# EAGLE design Via Card v2 (EAGLE 4.16)
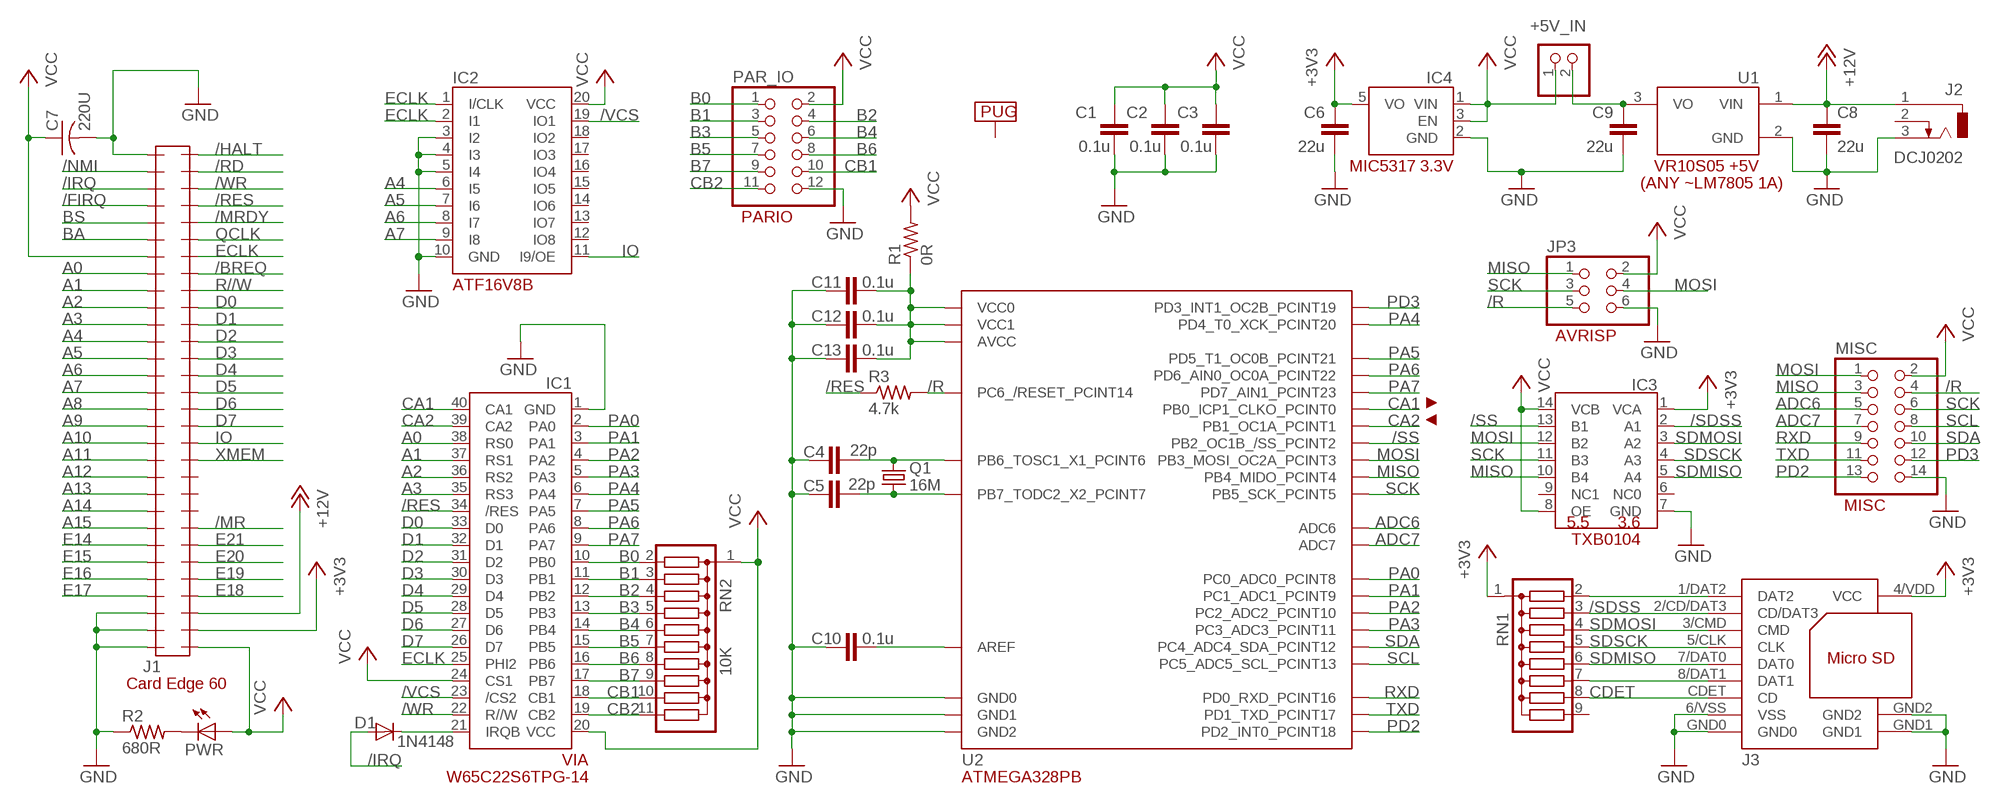
[diagram p0: schematic, sheet 1]

## Parts
+5V_IN  PINHD-1X2  [1X02]
C1  0.1u  C-EUC0603  [C0603]
C2  0.1u  C-EUC0603  [C0603]
C3  0.1u  C-EUC0603  [C0603]
C4  22p  C-EUC0603  [C0603]
C5  22p  C-EUC0603  [C0603]
C6  22u  C-EUC0805  [C0805]
C7  220U  C-US025-050X050  [C025-050X050]
C8  22u  C-EUC1206  [C1206]
C9  22u  C-EUC1206  [C1206]
C10  0.1u  C-EUC0603  [C0603]
C11  0.1u  C-EUC0603  [C0603]
C12  0.1u  C-EUC0603  [C0603]
C13  0.1u  C-EUC0603  [C0603]
D1  1N4148  [DO35-10]
IC1  W65C22S6TBG-14  [DIL40]
IC2  PLD_ATF16V8B  [DIL20]
IC3  TXB0104D  [SOIC14]
IC4  MIC5317_3.3V  [SOT23-5]
J1  CARDEDGE_2.54_60POS  CARDEDGE_2.54_60POSEDGE  [CARDEDGE_2.54_60POS]
J2  DCJ0202  [DCJ0202]
J3  MICROSD_AMPHENOL_GTFP084328  [MICROSD_AMPHENOL_GTFP08432B1HR]
JP3  PINHD-2X3  [2X03]
MISC  PINHD-2X7  [2X07]
PAR_IO  PINHD-2X6  [2X06]
PWR  LED3MM  [LED3MM]
Q1  16M  CRYSTALHC49S  [HC49/S]
R1  0R  R-US_R0603  [R0603]
R2  680R  R-US_R0603  [R0603]
R3  4.7k  R-US_R0603  [R0603]
RN1  G08R  [SIL9]
RN2  10K  G10R  [SIL11]
U1  VREG_5V_VR10S05  [VREG_5V_CP_POWER_VR10S05]
U2  ATMEGA238PTQFP_  [TQFP32-08]
U$1  PUG  [LARGE_PUG]

## Nets
+3V3 [supply]: C6.1 IC3.1(VCA) IC4.5(VO) J1.32 J3.4/VDD(VCC) RN1.1
+12V [supply]: C8.1 J1.33 J2.1 U1.1(VIN)
/BREQ: J1.53
/FIRQ: J1.4
/HALT: J1.60
/IRQ: D1.A J1.3
/MR: J1.38
/MRDY: J1.56
/NMI: J1.2
/R: JP3.5 MISC.4 R3.2 U2.29(PC6_/RESET_PCINT14)
/RD: J1.59
/RES: IC1.34(/RES) J1.57 R3.1
/SDSS: IC3.2(A1) J3.2/CD/DAT3(CD/DAT3) RN1.3
/SS: IC3.13(B1) U2.14(PB2_OC1B_/SS_PCINT2)
/VCS: IC1.23(/CS2) IC2.19(IO1)
/WR: IC1.22(R//W) J1.58
A0: IC1.38(RS0) J1.8
A1: IC1.37(RS1) J1.9
A2: IC1.36(RS2) J1.10
A3: IC1.35(RS3) J1.11
A4: IC2.6(I5) J1.12
A5: IC2.7(I6) J1.13
A6: IC2.8(I7) J1.14
A7: IC2.9(I8) J1.15
A8: J1.16
A9: J1.17
A10: J1.18
A11: J1.19
A12: J1.20
A13: J1.21
A14: J1.22
A15: J1.23
ADC6: MISC.5 U2.19(ADC6)
ADC7: MISC.7 U2.22(ADC7)
B0: IC1.10(PB0) PAR_IO.1 RN2.2
B1: IC1.11(PB1) PAR_IO.3 RN2.3
B2: IC1.12(PB2) PAR_IO.4 RN2.4
B3: IC1.13(PB3) PAR_IO.5 RN2.5
B4: IC1.14(PB4) PAR_IO.6 RN2.6
B5: IC1.15(PB5) PAR_IO.7 RN2.7
B6: IC1.16(PB6) PAR_IO.8 RN2.8
B7: IC1.17(PB7) PAR_IO.9 RN2.9
BA: J1.6
BS: J1.5
CA1: IC1.40(CA1) U2.12(PB0_ICP1_CLKO_PCINT0)
CA2: IC1.39(CA2) U2.13(PB1_OC1A_PCINT1)
CB1: IC1.18(CB1) PAR_IO.10 RN2.10
CB2: IC1.19(CB2) PAR_IO.11 RN2.11
CDET: J3.CDET(CD) RN1.8
D0: IC1.33(D0) J1.51
D1: IC1.32(D1) J1.50
D2: IC1.31(D2) J1.49
D3: IC1.30(D3) J1.48
D4: IC1.29(D4) J1.47
D5: IC1.28(D5) J1.46
D6: IC1.27(D6) J1.45
D7: IC1.26(D7) J1.44
E14: J1.24
E15: J1.25
E16: J1.26
E17: J1.27
E18: J1.34
E19: J1.35
E20: J1.36
E21: J1.37
ECLK: IC1.25(PHI2) IC2.1(I/CLK) IC2.2(I1) J1.54
GND [lowpwr]: C1.2 C2.2 C3.2 C4.1 C5.1 C6.2 C7.2 C8.2 C9.2 C10.1 C11.1 C12.1 C13.1 IC1.1(GND) IC2.3(I2) IC2.4(I3) IC2.5(I4) IC2.10(GND) IC3.7(GND) IC4.2(GND) J1.1 J1.28 J1.29 J1.30 J2.3 J3.6/VSS(VSS) J3.GND0 J3.GND1 J3.GND2 JP3.6 MISC.14 PAR_IO.12 R2.1 U1.2(GND) U2.3(GND0) U2.5(GND1) U2.21(GND2)
IO: IC2.11(I9/OE) J1.43
MISO: IC3.10(B4) JP3.1 MISC.3 U2.16(PB4_MIDO_PCINT4)
MOSI: IC3.12(B2) JP3.4 MISC.1 U2.15(PB3_MOSI_OC2A_PCINT3)
N$1: J3.1/DAT2(DAT2) RN1.2
N$2: PWR.K(C) R2.2
N$3 [lowpwr]: C11.2 C12.2 C13.2 R1.1 U2.4(VCC0) U2.6(VCC1) U2.18(AVCC)
N$6 [supply]: +5V_IN.2 C9.1 U1.3(VO)
N$7: J3.8/DAT1(DAT1) RN1.7
N$13: D1.C IC1.21(IRQB)
N$15: C4.2 Q1.2 U2.7(PB6_TOSC1_X1_PCINT6)
N$16: C5.2 Q1.1 U2.8(PB7_TODC2_X2_PCINT7)
N$18 [lowpwr]: C10.2 U2.20(AREF)
PA0: IC1.2(PA0) U2.23(PC0_ADC0_PCINT8)
PA1: IC1.3(PA1) U2.24(PC1_ADC1_PCINT9)
PA2: IC1.4(PA2) U2.25(PC2_ADC2_PCINT10)
PA3: IC1.5(PA3) U2.26(PC3_ADC3_PCINT11)
PA4: IC1.6(PA4) U2.2(PD4_T0_XCK_PCINT20)
PA5: IC1.7(PA5) U2.9(PD5_T1_OC0B_PCINT21)
PA6: IC1.8(PA6) U2.10(PD6_AIN0_OC0A_PCINT22)
PA7: IC1.9(PA7) U2.11(PD7_AIN1_PCINT23)
PD2: MISC.13 U2.32(PD2_INT0_PCINT18)
PD3: MISC.12 U2.1(PD3_INT1_OC2B_PCINT19)
QCLK: J1.55
R//W: J1.52
RXD: MISC.9 U2.30(PD0_RXD_PCINT16)
SCK: IC3.11(B3) JP3.3 MISC.6 U2.17(PB5_SCK_PCINT5)
SCL: MISC.8 U2.28(PC5_ADC5_SCL_PCINT13)
SDA: MISC.10 U2.27(PC4_ADC4_SDA_PCINT12)
SDMISO [lowpwr]: IC3.5(A4) J3.7/DAT0(DAT0) RN1.6
SDMOSI [lowpwr]: IC3.3(A2) J3.3/CMD(CMD) RN1.4
SDSCK [lowpwr]: IC3.4(A3) J3.5/CLK(CLK) RN1.5
TXD: MISC.11 U2.31(PD1_TXD_PCINT17)
VCC [supply]: +5V_IN.1 C1.1 C2.1 C3.1 C7.1 IC1.20(VCC) IC1.24(CS1) IC2.20(VCC) IC3.8(OE) IC3.14(VCB) IC4.1(VIN) IC4.3(EN) J1.7 J1.31 JP3.2 MISC.2 PAR_IO.2 PWR.A R1.2 RN2.1
XMEM: J1.42
Unconnected: IC2.12(IO8) IC2.13(IO7) IC2.14(IO6) IC2.15(IO5) IC2.16(IO4) IC2.17(IO3) IC2.18(IO2) IC3.6(NC0) IC3.9(NC1) J1.39 J1.40 J1.41 J2.2 RN1.9 U$1.P$1

## Notes on the sheet
- (ANY ~LM7805 1A)
- PARIO
- AVRISP
- MISC
- ATMEGA328PB

## Library data of the parts
+5V_IN = pinhead:PINHD-1X2: PIN HEADER
C1-C6 C8-C13 = rcl:C-EU: CAPACITOR, European symbol
C7 = rcl:C-US: CAPACITOR, American symbol
D1 = diode:1N4148: DIODE high speed (Philips)
IC1 = 07-Retrocomputing:W65C22S6TBG-14
IC2 = 07-Retrocomputing:PLD_ATF16V8B
IC3 = 07-Retrocomputing:TXB0104
IC4 = 07-Retrocomputing:MIC5317_3.3V
J1 = 07-Retrocomputing:CARDEDGE_2.54_60POS
J2 = con-jack:DCJ0202: DC POWER JACK Source: DCJ0202.pdf
J3 = 07-Retrocomputing:MICROSD_AMPHENOL_GTFP084328
JP3 = pinhead:PINHD-2X3: PIN HEADER
MISC = pinhead:PINHD-2X7: PIN HEADER
PAR_IO = pinhead:PINHD-2X6: PIN HEADER
PWR = led:LED: LED OSRAM: - CHIPLED LG R971, LG N971, LY N971, LG Q971, LY Q971, LO R971, LY R971 LH N974, LH R974 LS Q976, LO Q976, LY Q976 LO Q996 - Hyper CHIPLED LW Q18S LB Q993, LB Q99A, LB R99A - SideLED LS A670, LO A670, LY A670, LG A670, LP A670 LB A673, LV A673, LT A673, LW A673 LH A674 LY A675 LS A676, LA A676, LO A676, LY A676, LW A676 LS A679, LY A679, LG A679 - Hyper Micro SIDELED® LS Y876, LA Y876, LO Y876, LY Y876 LT Y87S - SmartLED LW L88C, LW L88S LB L89C, LB L89S, LG L890 LS L89K, LO L89K, LY L89K LS L896, LA L896, LO L896, LY L896 - TOPLED LS T670, LO T670, LY T670, LG T670, LP T670 LSG T670, LSP T670, LSY T670, LOP T670, LYG T670 LG T671, LOG T671, LSG T671 LB T673, LV T673, LT T673, LW T673 LH T674 LS T676, LA T676, LO T676, LY T676, LB T676, LH T676, LSB T676, LW T676 LB T67C, LV T67C, LT T67C, LS T67K, LO T67K, LY T67K, LW E67C LS E67B, LA E67B, LO E67B, LY E67B, LB E67C, LV E67C, LT E67C LW T67C LS T679, LY T679, LG T679 LS T770, LO T770, LY T770, LG T770, LP T770 LB T773, LV T773, LT T773, LW T773 LH T774 LS E675, LA E675, LY E675, LS T675 LS T776, LA T776, LO T776, LY T776, LB T776 LHGB T686 LT T68C, LB T68C - Hyper Mini TOPLED® LB M676 - Mini TOPLED Santana® LG M470 LS M47K, LO M47K, LY M47K Source: http://www.osram.convergy.de - LUMILED® LXK2-PW12-R00, LXK2-PW12-S00, LXK2-PW14-U00, LXK2-PW14-V00 LXK2-PM12-R00, LXK2-PM12-S00, LXK2-PM14-U00 LXK2-PE12-Q00, LXK2-PE12-R00, LXK2-PE12-S00, LXK2-PE14-T00, LXK2-PE14-U00 LXK2-PB12-K00, LXK2-PB12-L00, LXK2-PB12-M00, LXK2-PB14-N00, LXK2-PB14-P00, LXK2-PB14-Q00 LXK2-PR12-L00, LXK2-PR12-M00, LXK2-PR14-Q00, LXK2-PR14-R00 LXK2-PD12-Q00, LXK2-PD12-R00, LXK2-PD12-S00 LXK2-PH12-R00, LXK2-PH12-S00 LXK2-PL12-P00, LXK2-PL12-Q00, LXK2-PL12-R00 Source: www.luxeon.com
Q1 = crystal:CRYSTAL: CRYSTAL
R1-R3 = rcl:R-US_: RESISTOR, American symbol
RN1 = resistor-sil:G08R: SIL RESISTOR
RN2 = resistor-sil:G10R: SIL RESISTOR
U1 = 07-Retrocomputing:VREG_5V_VR10S05
U2 = 02_atmel:ATMEGA238P
U$1 = 07-Retrocomputing:PUG

## Net classes
0 default: width 0.203 mm, drill 0.203 mm, clearance 0.254 mm
1 supply: width 0.61 mm, drill 0.203 mm, clearance 0.305 mm
2 lowpwr: width 0.254 mm, drill 0.203 mm, clearance 0.254 mm

## Board
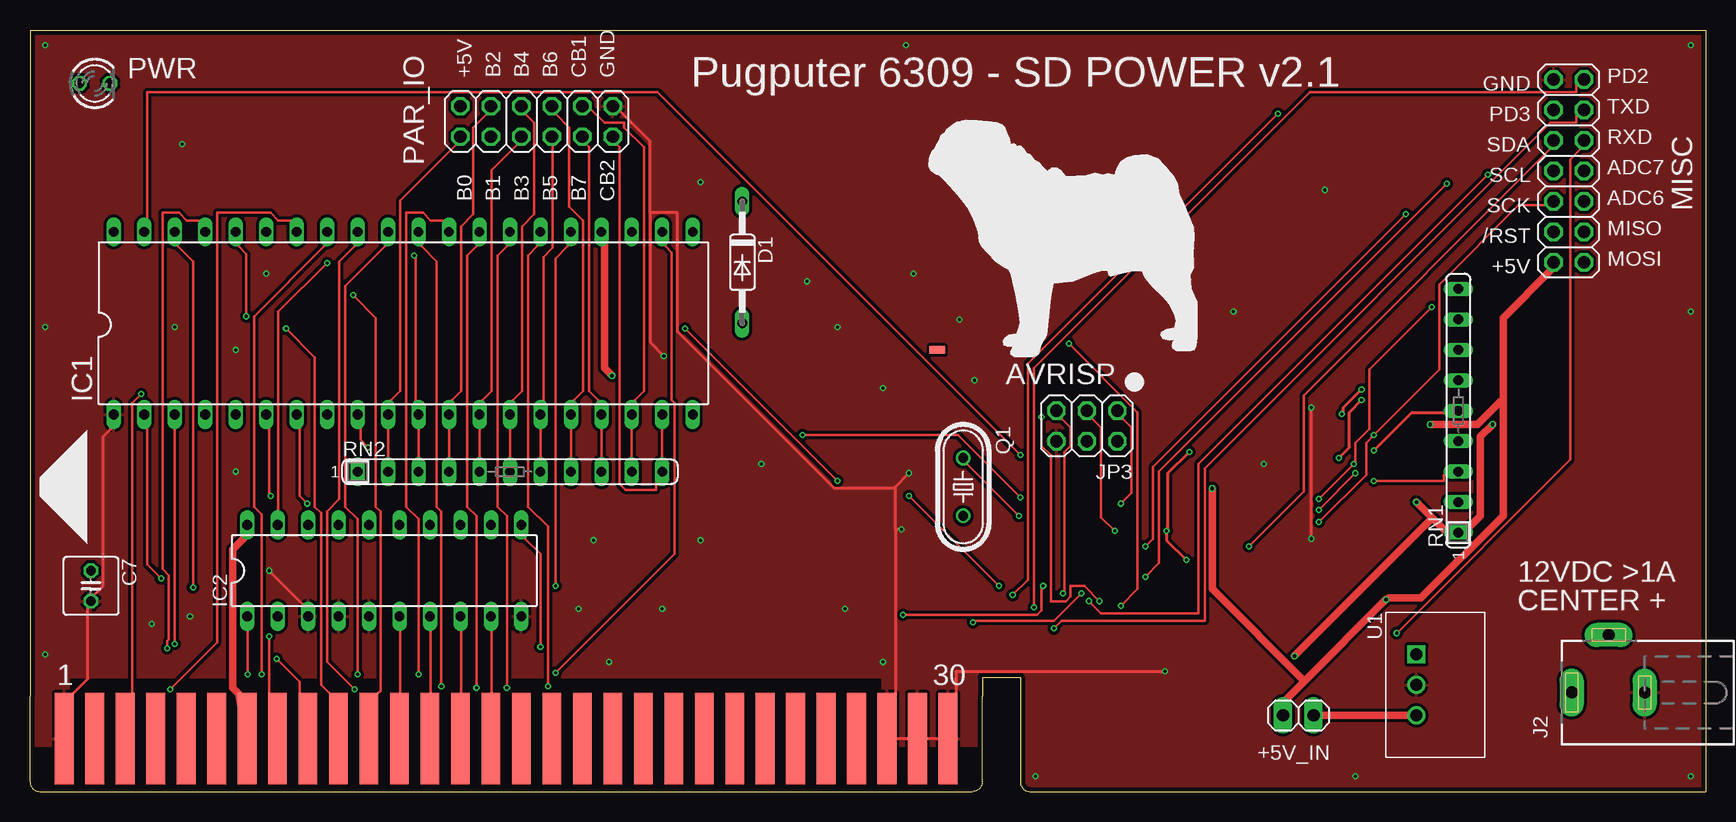
[diagram p1: board, top side]
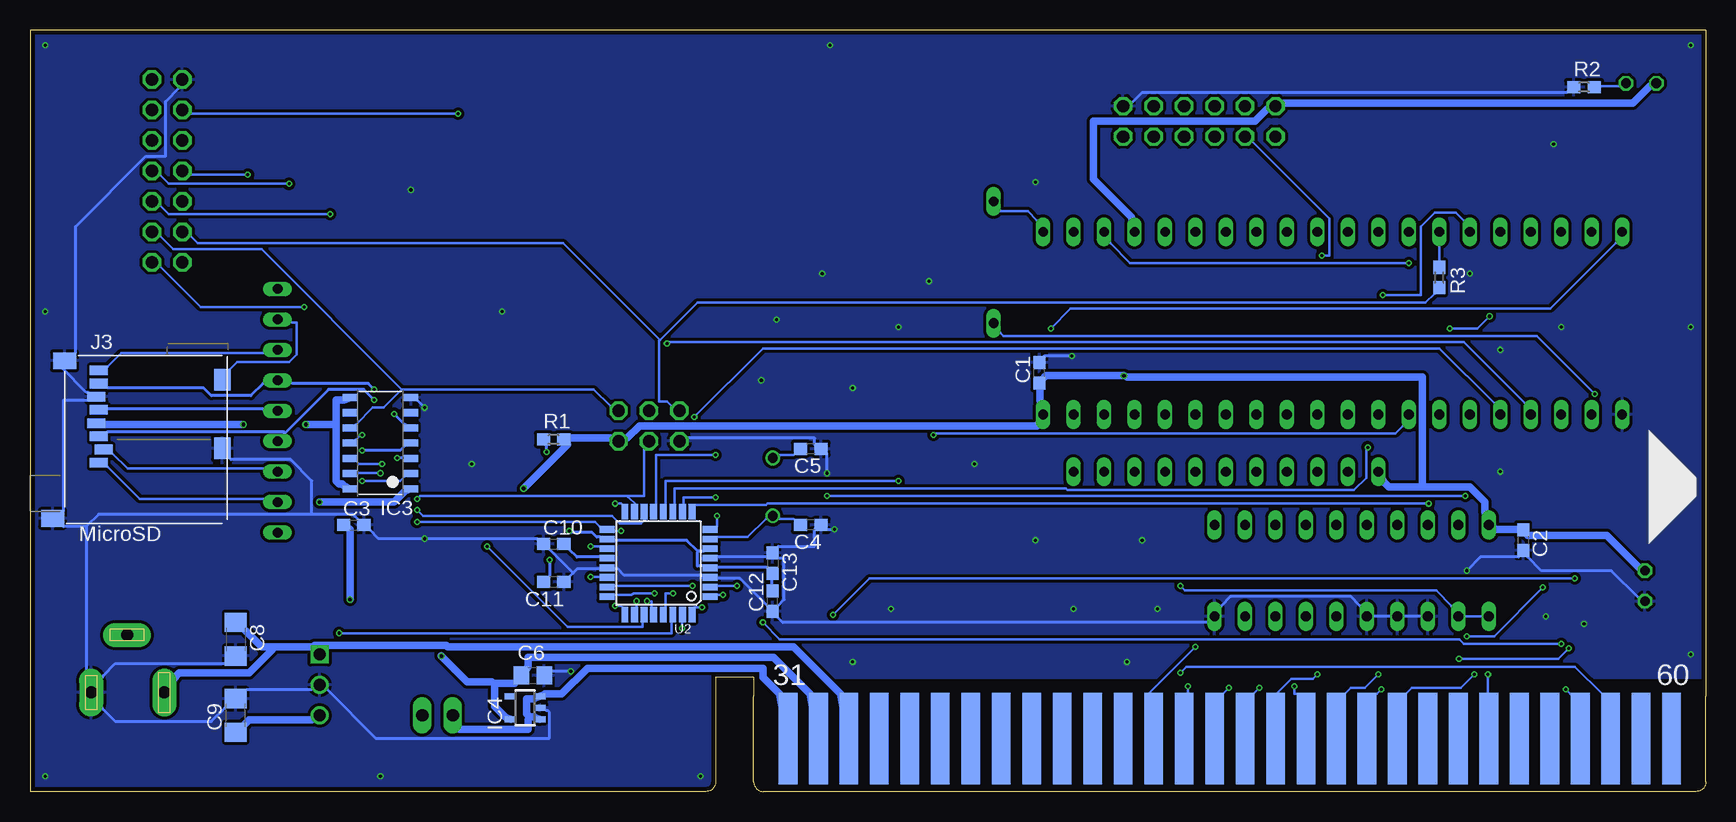
[diagram p2: board, bottom side, seen from below]

Size 139.7 x 63.5 mm. Coordinates in mm from the lower left corner, seen from the top.
Outline: 0,7.94 0,63.5 139.7,63.5 139.7,0 83.34,0 arc-90 82.55,0.79 82.55,9.53 79.38,9.53 79.38,7.94
Copper layers (1*16): Top 0.0356mm / dielectric 1.6mm / Bottom 0.0356mm
Design rules "oshpark-2layer": minimum track width 6mil, minimum drill 10mil, track to track 6mil, track to pad 6mil, pad to pad 6mil, via to via 6mil, smd to smd 6mil, copper to edge 15mil, drill to drill 6mil, minimum pad ring 5mil, minimum via ring 5mil, stop-mask expansion 2.5mil, vias tented up to drill 0mil, thermal gap 10mil
vRestrict: area 122.2,21.4 to 139.7,38.1

### Footprints (pad centres in the part's own frame; a part is rotated, then mirrored left to right if it is on the bottom)
1X02 = drill 1.016 long: 1 -1.27,0; 2 1.27,0
C0603 = smd 1.1 x 1: 1 -0.85,0; 2 0.85,0
C0805 = smd 1.3 x 1.5: 1 -0.95,0; 2 0.95,0
C025-050X050 = drill 0.813 octagon: 1 -1.27,0; 2 1.27,0
C1206 = smd 1.6 x 1.8: 1 -1.4,0; 2 1.4,0
DO35-10 = drill 0.813 long: A 5.08,0; C -5.08,0
DIL40 = drill 0.813 long: 1 -24.13,-7.62; 2 -21.59,-7.62; 3 -19.05,-7.62; 4 -16.51,-7.62; 5 -13.97,-7.62; 6 -11.43,-7.62; 7 -8.89,-7.62; 8 -6.35,-7.62; 9 -3.81,-7.62; 10 -1.27,-7.62; 11 1.27,-7.62; 12 3.81,-7.62; 13 6.35,-7.62; 14 8.89,-7.62; 15 11.43,-7.62; 16 13.97,-7.62; 17 16.51,-7.62; 18 19.05,-7.62; 19 21.59,-7.62; 20 24.13,-7.62; 21 24.13,7.62; 22 21.59,7.62; 23 19.05,7.62; 24 16.51,7.62; 25 13.97,7.62; 26 11.43,7.62; 27 8.89,7.62; 28 6.35,7.62; 29 3.81,7.62; 30 1.27,7.62; 31 -1.27,7.62; 32 -3.81,7.62; 33 -6.35,7.62; 34 -8.89,7.62; 35 -11.43,7.62; 36 -13.97,7.62; 37 -16.51,7.62; 38 -19.05,7.62; 39 -21.59,7.62; 40 -24.13,7.62
DIL20 = drill 0.813 long: 1 -11.43,-3.81; 2 -8.89,-3.81; 3 -6.35,-3.81; 4 -3.81,-3.81; 5 -1.27,-3.81; 6 1.27,-3.81; 7 3.81,-3.81; 8 6.35,-3.81; 9 8.89,-3.81; 10 11.43,-3.81; 11 11.43,3.81; 12 8.89,3.81; 13 6.35,3.81; 14 3.81,3.81; 15 1.27,3.81; 16 -1.27,3.81; 17 -3.81,3.81; 18 -6.35,3.81; 19 -8.89,3.81; 20 -11.43,3.81
SOIC14 = smd 1.2 x 0.6: 1 -2.54,3.81; 2 -2.54,2.54; 3 -2.54,1.27; 4 -2.54,0; 5 -2.54,-1.27; 6 -2.54,-2.54; 7 -2.54,-3.81; 8 2.54,-3.81; 9 2.54,-2.54; 10 2.54,-1.27; 11 2.54,0; 12 2.54,1.27; 13 2.54,2.54; 14 2.54,3.81
SOT23-5 = smd 0.5 x 1: 1 -0.95,-1.2; 2 0,-1.2; 3 0.95,-1.2; 4 0.95,1.2; 5 -0.95,1.2
CARDEDGE_2.54_60POS = smd 1.556 x 7.62: 1 -36.83,4.41; 2 -34.29,4.41; 3 -31.75,4.41; 4 -29.21,4.41; 5 -26.67,4.41; 6 -24.13,4.41; 7 -21.59,4.41; 8 -19.05,4.41; 9 -16.51,4.41; 10 -13.97,4.41; 11 -11.43,4.41; 12 -8.89,4.41; 13 -6.35,4.41; 14 -3.81,4.41; 15 -1.27,4.41; 16 1.27,4.41; 17 3.81,4.41; 18 6.35,4.41; 19 8.89,4.41; 20 11.43,4.41; 21 13.97,4.41; 22 16.51,4.41; 23 19.05,4.41; 24 21.59,4.41; 25 24.13,4.41; 26 26.67,4.41; 27 29.21,4.41; 28 31.75,4.41; 29 34.29,4.41; 30 36.83,4.41 | smd 1.556 x 7.62 bottom: 31 36.83,4.41; 32 34.29,4.41; 33 31.75,4.41; 34 29.21,4.41; 35 26.67,4.41; 36 24.13,4.41; 37 21.59,4.41; 38 19.05,4.41; 39 16.51,4.41; 40 13.97,4.41; 41 11.43,4.41; 42 8.89,4.41; 43 6.35,4.41; 44 3.81,4.41; 45 1.27,4.41; 46 -1.27,4.41; 47 -3.81,4.41; 48 -6.35,4.41; 49 -8.89,4.41; 50 -11.43,4.41; 51 -13.97,4.41; 52 -16.51,4.41; 53 -19.05,4.41; 54 -21.59,4.41; 55 -24.13,4.41; 56 -26.67,4.41; 57 -29.21,4.41; 58 -31.75,4.41; 59 -34.29,4.41; 60 -36.83,4.41
DCJ0202 = drill 1 pad 2 long: 1 0,3.1; 2 4.8,0; 3 0,-3
MICROSD_AMPHENOL_GTFP08432B1HR = smd 0.8 x 1.5: 1/DAT2 1.95,-10.3; 2/CD/DAT3 0.85,-9.9; 3/CMD -0.25,-10.3; 4/VDD -1.35,-10.5; 5/CLK -2.45,-10.3; 6/VSS -3.55,-10.5; 7/DAT0 -4.65,-10.3; 8/DAT1 -5.75,-10.3 | smd 1.8 x 1.4: CDET -4.95,0; GND0 0.75,0 | smd 1.4 x 1.9: GND1 -6.55,-13.15; GND2 6.6,-14.15
2X03 = drill 1.016 octagon: 1 -2.54,-1.27; 2 -2.54,1.27; 3 0,-1.27; 4 0,1.27; 5 2.54,-1.27; 6 2.54,1.27
2X07 = drill 1.016 octagon: 1 -7.62,-1.27; 2 -7.62,1.27; 3 -5.08,-1.27; 4 -5.08,1.27; 5 -2.54,-1.27; 6 -2.54,1.27; 7 0,-1.27; 8 0,1.27; 9 2.54,-1.27; 10 2.54,1.27; 11 5.08,-1.27; 12 5.08,1.27; 13 7.62,-1.27; 14 7.62,1.27
2X06 = drill 1.016 octagon: 1 -6.35,-1.27; 2 -6.35,1.27; 3 -3.81,-1.27; 4 -3.81,1.27; 5 -1.27,-1.27; 6 -1.27,1.27; 7 1.27,-1.27; 8 1.27,1.27; 9 3.81,-1.27; 10 3.81,1.27; 11 6.35,-1.27; 12 6.35,1.27
LED3MM = drill 0.813 octagon: A -1.27,0; K 1.27,0
HC49/S = drill 0.813 round: 1 -2.413,0; 2 2.413,0
R0603 = smd 1.1 x 1: 1 -0.85,0; 2 0.85,0
SIL9 = drill 0.813 long: 1 -10.16,0; 2 -7.62,0; 3 -5.08,0; 4 -2.54,0; 5 0,0; 6 2.54,0; 7 5.08,0; 8 7.62,0; 9 10.16,0
SIL11 = drill 0.813 long: 1 -12.7,0; 2 -10.16,0; 3 -7.62,0; 4 -5.08,0; 5 -2.54,0; 6 0,0; 7 2.54,0; 8 5.08,0; 9 7.62,0; 10 10.16,0; 11 12.7,0
VREG_5V_CP_POWER_VR10S05 = drill 1 square: 1 -2.54,0 | drill 1 round: 2 0,0; 3 2.54,0
TQFP32-08 = smd 1.27 x 0.559: 1 -4.293,2.8; 2 -4.293,2; 3 -4.293,1.2; 4 -4.293,0.4; 5 -4.293,-0.4; 6 -4.293,-1.2; 7 -4.293,-2; 8 -4.293,-2.8; 17 4.293,-2.8; 18 4.293,-2; 19 4.293,-1.2; 20 4.293,-0.4; 21 4.293,0.4; 22 4.293,1.2; 23 4.293,2; 24 4.293,2.8 | smd 0.559 x 1.27: 9 -2.8,-4.293; 10 -2,-4.293; 11 -1.2,-4.293; 12 -0.4,-4.293; 13 0.4,-4.293; 14 1.2,-4.293; 15 2,-4.293; 16 2.8,-4.293; 25 2.8,4.293; 26 2,4.293; 27 1.2,4.293; 28 0.4,4.293; 29 -0.4,4.293; 30 -1.2,4.293; 31 -2,4.293; 32 -2.8,4.293
LARGE_PUG = smd 1.27 x 0.635: P$1 2.286,3.962

### Placement (x,y rotation side)
+5V_IN  105.73,6.35 0 top
C1  55.56,34.92 90 bottom
C2  15.24,20.95 270 bottom
C3  112.71,22.23 0 bottom
C4  74.61,22.23 180 bottom
C5  74.61,28.57 180 bottom
C6  97.79,9.68 0 bottom
C7  5.08,17.14 270 top
C8  122.56,12.7 270 bottom
C9  122.56,6.35 90 bottom
C10  96.04,20.64 0 bottom
C11  96.04,17.46 180 bottom
C12  77.79,15.88 90 bottom
C13  77.79,19.05 270 bottom
D1  59.37,44.13 270 top
IC1  31.11,39.05 0 top
IC2  29.53,18.41 0 top
IC3  110.49,29.05 180 bottom
IC4  98.42,6.99 90 bottom
J1  39.69,0 0 top
J2  131.6,8.26 90 top
J3  123.67,29.37 270 bottom
JP3  88.11,30.48 180 top
MISC  128.27,51.75 90 top
PAR_IO  42.23,55.88 0 top
PWR  5.4,59.05 0 top
Q1  77.79,25.4 270 top
R1  96.04,29.37 0 bottom
R2  10.16,58.74 0 bottom
R3  22.23,42.86 270 bottom
RN1  119.06,31.75 90 top
RN2  40.01,26.67 0 top
U1  115.57,8.89 270 top
U2  87.31,19.05 180 bottom
U$1  73.34,32.86 0 top

### Tracks (layer width: path | path; a pad name or v marks a point on that pad's centre or on a via)
+3V3  (via drill 0.3)
  Top 0.61: 116.9,22.8 117.86,21.84 RN1.1 120.02,22.1 120.9,22.99 120.9,29.59 v121.92,30.61 | 116.9,22.8 v115.57,24.13 | v105.41,11.3 116.9,22.8
  Bottom 0.61: v115.57,24.13 109.35,24.13 108.46,25.02 IC3.1 | v121.92,30.61 133.48,30.61 J3.4/VDD | 100.97,9.02 100.97,7.11 100.08,6.22 IC4.5 | 100.97,9.02 99.31,9.02 C6.1 98.17,10.41 98.17,11.18 77.72,11.18 74.68,8.13 J1.32 | v105.41,11.3 103.25,9.14 101.22,9.14 100.97,9.02
+12V
  Bottom 0.61: 116.2,12.06 119.51,12.06 | 119.51,12.06 120.4,12.06 121.67,13.34 C8.1 | 116.2,12.06 U1.1 | J2.1 127.51,9.65 127.25,9.91 121.41,9.91 119.51,11.81 119.51,12.06 | J1.33 72.14,8.13 76.07,12.06 104.9,12.06 105.03,12.19 115.95,12.19 116.2,12.06
/IRQ  (via drill 0.25)
  Top 0.203: v9.27,33.15 8.51,32.38 8.51,8.13 J1.3
  Bottom 0.203: v9.27,33.15 14.1,37.97 58.55,37.97 58.8,38.23 D1.A
/R  (via drill 0.25)
  Top 0.203: v86.11,16.51 86.23,16.64 86.23,28.32 86.74,28.83 86.74,30.35 85.98,31.11 JP3.5
  Bottom 0.203: 87.19,37.66 87.25,37.59 87.25,32.51 86.61,32.51 86.23,32.13 JP3.5 | 87.19,37.66 84.07,40.77 23.37,40.77 22.61,41.53 R3.2 | v86.11,16.51 86.74,16.51 86.74,15.37 U2.29 | MISC.4 126.36,46.35 125.73,45.72 95.25,45.72 87.19,37.66
/RES  (via drill 0.25)
  Top 0.203: v11.68,8.51 15.62,12.45 15.62,48.26 20.07,48.26 20.7,47.62 21.72,47.62 IC1.34
  Bottom 0.203: IC1.34 R3.1 | v11.68,8.51 11.3,8.13 11.18,8.13 J1.57
/SDSS  (via drill 0.25)
  Top 0.203: v112.01,25.91 117.86,25.91 117.86,26.42 RN1.3
  Bottom 0.203: v112.01,25.91 108.84,25.91 108.46,26.29 IC3.2 | J3.2/CD/DAT3 132.84,28.19 131.57,26.92 120.27,26.92 RN1.3
/SS  (via drill 0.25)
  Top 0.203: v107.44,23.5 v110.49,26.54
  Bottom 0.203: v110.49,26.54 112.52,26.54 IC3.13 | v107.44,23.5 106.93,22.99 91.19,22.99 90.55,22.35 88.77,22.35 88.39,22.73 U2.14
/VCS  (via drill 0.25)
  Top 0.203: v24.77,44.07 20.7,40.01 20.7,23.37 IC2.19
  Bottom 0.203: v24.77,44.07 48.01,44.07 49.66,45.72 IC1.23
/WR  (via drill 0.25)
  Top 0.203: v43.81,9.91 53.72,19.81 53.72,32.38 53.47,32.64 53.47,44.96 52.96,45.47 IC1.22
  Bottom 0.203: v43.81,9.91 43.31,10.41 10.92,10.41 8.64,8.13 J1.58
A0  (via drill 0.25)
  Top 0.203: v13.59,17.02 13.59,44.2 12.32,45.47 IC1.38 | v19.94,12.95 19.94,8.13 J1.8
  Bottom 0.203: v13.59,17.02 17.65,12.95 v19.94,12.95
A1  (via drill 0.25)
  Top 0.203: v11.43,11.94 11.43,12.57 11.56,12.7 11.56,18.03 11.05,18.54 11.05,48.26 12.45,48.26 13.08,47.62 14.1,47.62 IC1.37 | v20.57,11.05 22.48,9.14 22.48,8.13 J1.9
  Bottom 0.203: v11.43,11.94 12.32,11.05 v20.57,11.05
A2  (via drill 0.25)
  Top 0.203: v18.03,39.62 18.03,44.83 17.4,45.47 IC1.36 | v21.34,38.61 23.75,36.2 23.75,23.75 24.26,23.24 24.26,8.89 25.02,8.13 J1.10
  Bottom 0.203: v18.03,39.62 19.05,38.61 v21.34,38.61
A3  (via drill 0.25)
  Top 0.203: v26.92,41.4 28.83,39.5 28.83,23.75 29.21,23.37 29.21,8.38 28.96,8.13 J1.11
  Bottom 0.203: v26.92,41.4 23.75,41.4 23.75,47.12 22.61,48.26 20.83,48.26 20.19,47.62 IC1.35
A4
  Top 0.203: IC2.6 30.86,13.46 30.86,8.13 J1.12
A5
  Top 0.203: IC2.7 33.4,13.46 33.4,8.13 J1.13
A6
  Top 0.203: IC2.8 35.94,13.46 35.94,8.13 J1.14
A7
  Top 0.203: IC2.9 38.48,13.46 38.48,8.13 J1.15
ADC6  (via drill 0.25)
  Top 0.203: v92.96,20.45 93.6,21.08 93.6,27.05 v114.68,48.13
  Bottom 0.203: v92.96,20.45 92.2,20.45 U2.19 | v114.68,48.13 128.14,48.13 128.91,48.9 MISC.5
ADC7  (via drill 0.25)
  Top 0.203: v92.96,17.91 94.11,19.05 94.11,26.67 v118.11,50.67
  Bottom 0.203: v92.96,17.91 92.2,17.91 U2.22 | v118.11,50.67 128.14,50.67 128.91,51.44 MISC.7
B0
  Top 0.203: RN2.2 IC1.10 30.1,32.64 30.86,33.4 30.86,49.28 35.56,53.98 PAR_IO.1
B1  (via drill 0.25)
  Top 0.203: RN2.3 IC1.11 32.13,32.64 32.13,44.58 v32,44.7
  Bottom 0.203: v32,44.7 31.37,44.7 31.37,47.75 37.85,54.23 PAR_IO.3
B2
  Top 0.203: RN2.4 IC1.12 35.18,32.64 35.94,33.4 35.94,47.12 36.96,48.13 36.96,55.37 38.1,56.52 PAR_IO.4
B3
  Top 0.203: RN2.5 IC1.13 37.72,32.64 38.48,33.4 38.48,51.82 40.64,53.98 PAR_IO.5
B4
  Top 0.203: RN2.6 IC1.14 40.26,32.64 41.02,33.4 41.02,47.12 42.04,48.13 42.04,55.75 41.27,56.52 PAR_IO.6
B5
  Top 0.203: RN2.7 IC1.15 42.8,32.64 42.8,44.58 43.56,45.34 43.56,53.98 PAR_IO.7
B6
  Top 0.203: RN2.8 IC1.16 45.34,32.64 46.1,33.4 46.1,47.62 44.96,48.77 44.96,55.37 43.81,56.52 PAR_IO.8
B7
  Top 0.203: RN2.9 IC1.17 47.37,32.64 46.61,33.4 46.61,53.72 46.35,53.98 PAR_IO.9
CA1  (via drill 0.25)
  Top 0.203: v54.61,38.61 v67.31,25.91
  Bottom 0.203: v67.31,25.91 86.74,25.91 86.74,23.88 U2.12 | v54.61,38.61 52.96,40.26 12.95,40.26 7.49,45.72 IC1.40
CA2  (via drill 0.25)
  Top 0.203: v82.55,28.07 52.32,58.29 9.78,58.29 9.78,47.88 IC1.39
  Bottom 0.203: v82.55,28.07 87.5,28.07 87.5,23.88 U2.13
CB1
  Top 0.203: RN2.10 IC1.18 50.42,32.64 51.18,33.4 51.18,53.72 49.53,55.37 49.53,55.75 47.88,55.75 46.74,56.9 PAR_IO.10
CB2
  Top 0.203: IC1.19 RN2.11 52.2,25.78 52.2,25.15 49.66,25.15 49.15,25.65 49.15,53.72 48.9,53.98 PAR_IO.11
CDET
  Bottom 0.203: J3.CDET 123.06,35.18 122.43,35.81 118.11,35.81 117.47,36.45 117.47,39.12 117.86,39.12 RN1.8
D0  (via drill 0.25)
  Top 0.203: v19.3,9.78 19.3,23.11 18.67,23.75 18.67,39.62 24.51,45.47 IC1.33
  Bottom 0.203: v19.3,9.78 20.45,8.64 24.51,8.64 25.02,8.13 J1.51
D1  (via drill 0.25)
  Top 0.203: v27.05,8.51 24.77,10.79 24.77,23.37 25.78,24.38 25.78,44.2 27.05,45.47 IC1.32
  Bottom 0.203: v27.05,8.51 27.43,8.13 27.56,8.13 J1.50
D2  (via drill 0.25)
  Top 0.203: v27.3,9.78 27.3,22.73 26.29,23.75 26.29,42.16 29.59,45.47 IC1.31
  Bottom 0.203: v27.3,9.78 28.45,8.64 29.59,8.64 30.1,8.13 J1.49
D3  (via drill 0.25)
  Top 0.203: v34.29,8.76 34.29,23.37 33.91,23.75 33.91,44.2 32.64,45.47 IC1.30
  Bottom 0.203: v34.29,8.76 34.29,8.13 34.04,8.13 J1.48
D4  (via drill 0.25)
  Top 0.203: v32.38,9.78 32.38,22.73 31.37,23.75 31.37,48.26 32.77,48.26 33.4,47.62 34.42,47.62 IC1.29
  Bottom 0.203: v32.38,9.78 32.77,9.4 34.54,9.4 35.81,8.13 J1.47
D5  (via drill 0.25)
  Top 0.203: v37.21,8.64 37.21,22.99 36.45,23.75 36.45,44.7 37.21,45.47 IC1.28
  Bottom 0.203: v37.21,8.64 37.72,8.13 J1.46
D6  (via drill 0.25)
  Top 0.203: v39.75,8.64 39.75,22.99 38.99,23.75 38.99,44.7 39.75,45.47 IC1.27
  Bottom 0.203: v39.75,8.64 40.26,8.13 J1.45
D7  (via drill 0.25)
  Top 0.203: v43.18,8.76 43.18,22.1 41.53,23.75 41.53,44.7 42.29,45.47 IC1.26
  Bottom 0.203: v43.18,8.76 43.18,8.13 J1.44
ECLK  (via drill 0.25)
  Top 0.203: v43.81,17.14 43.81,44.45 44.83,45.47 IC1.25 | v18.16,9.78 18.16,13.46 IC2.1
  Bottom 0.203: IC2.1 IC2.2 21.21,15.49 22.48,16.76 43.43,16.76 v43.81,17.14 | v18.16,9.78 18.16,8.13 J1.54
GND  (via drill 0.25)
  Top 0.254: IC1.1 6.73,30.23 6.1,29.59 6.1,17.14 5.33,16.38 C7.2 4.83,15.37 4.83,9.4 3.56,8.13 J1.1 | v19.94,18.41 22.73,15.62 IC2.3 | v52.83,36.32 51.69,37.47 51.69,48.26 | 51.69,48.26 51.69,54.23 49.15,56.77 PAR_IO.12 | v94.61,10.03 77.22,10.03 77.22,8.13 J1.30 75.82,4.45 74.68,4.45 J1.29 73.28,4.45 72.14,4.45 J1.28 72.14,8.13 72.14,21.84 | v73.28,26.54 72.14,25.4 72.14,25.27 | 72.14,21.84 72.14,25.27 | v106.81,21.08 v106.81,32 | v72.64,21.84 72.14,21.84 | 51.69,48.26 53.98,48.26 53.98,38.35 67.06,25.27 72.14,25.27
  Bottom 0.254: C8.2 123.44,10.67 132.59,10.67 133.6,9.65 J2.3 | IC4.2 96.77,6.86 96.65,6.73 96.52,6.73 96.39,6.6 96.39,4.45 110.87,4.45 114.94,8.51 U1.2 116.2,8.51 121.67,8.51 C9.2 123.44,6.99 124.59,5.84 132.59,5.84 133.6,6.86 J2.3 | MISC.14 127.25,58.67 128.4,57.53 128.4,52.96 130.05,52.96 135.89,47.12 135.89,36.58 J3.GND1 137.03,35.31 135,33.27 134.87,33.27 J3.6/VSS 134.87,32.64 136.91,32.64 136.91,23.37 J3.GND2 136.91,22.1 135,22.1 | 135,22.1 135,10.16 J2.3 | IC2.3 IC2.4 IC2.5 28.83,15.49 29.59,16.26 39.62,16.26 40.39,15.49 IC2.10 41.53,14.1 76.96,14.1 77.34,14.48 C12.1 | C7.2 5.59,16.13 7.87,18.41 13.72,18.41 14.86,19.56 C2.2 15.62,19.56 18.8,19.56 v19.94,18.41 | v52.83,36.32 55.12,36.32 C1.2 | R2.1 11.56,58.29 46.99,58.29 47.88,57.4 PAR_IO.12 | v94.61,10.03 96.27,10.03 C6.2 | JP3.6 84.84,29.46 74.3,29.46 74.3,28.96 C5.1 73.28,28.19 v73.28,26.54 | C12.1 78.23,15.49 80.52,17.78 82.42,17.78 U2.3 83.57,18.03 90.17,18.03 90.68,18.54 91.06,18.54 U2.21 92.2,18.54 94.11,18.54 94.42,18.22 | C13.1 78.23,19.56 82.42,19.56 U2.5 | C13.1 77.34,20.45 74.3,20.45 74.3,21.84 C4.1 73.28,21.84 v72.64,21.84 | C12.1 77.34,15.49 76.83,16 76.83,19.43 77.34,19.43 C13.1 | 94.42,18.22 94.74,17.91 C11.1 | 94.42,18.22 96.39,20.19 C10.1 97.41,21.08 v106.81,21.08 110.62,21.08 111.38,21.84 C3.2 112.27,22.61 112.78,23.11 116.2,23.11 | v106.81,32 107.44,32.64 IC3.7 | 116.2,23.11 116.2,25.91 117.98,27.69 122.94,27.69 123.06,27.81 J3.GND0 | 135,22.1 133.99,23.11 116.2,23.11
  other vias: 83.82,1.27 138.43,1.27 110.49,1.27 138.43,62.23 138.43,40.01 1.27,62.23 1.27,38.73 1.27,11.43 73.03,62.23 73.66,43.18 77.47,39.37 78.74,34.29 71.12,33.66 67.31,38.73 64.77,42.55 55.88,50.8 60.96,27.3 67.94,15.24 71.12,10.79 46.99,20.95 55.88,20.95 52.7,15.24 45.72,15.24 12.7,53.98 107.95,50.16 100.33,40.01 102.87,27.3 19.68,43.18 17.14,36.83 17.14,26.67 12.06,38.73 13.34,14.61 10.16,13.97 48.26,10.79
  pour Top: 0,63.5 139.7,63.5 139.7,0 82.55,0 82.55,9.53 79.38,9.53 79.38,3.81 71.12,3.81 71.12,9.53 3.17,9.53 3.17,3.81 0,3.81
  pour Bottom: 0,63.5 139.7,63.5 139.7,0 82.55,0 82.55,9.53 0,9.53
IO  (via drill 0.25)
  Top 0.203: v42.55,12.06 42.55,19.81 41.27,21.08 IC2.11
  Bottom 0.203: v42.55,12.06 46.48,8.13 J1.43
MISO  (via drill 0.25)
  Top 0.203: v90.93,24 91.82,24.89 91.82,30.35 91.06,31.11 JP3.1
  Bottom 0.203: 108.71,33.53 110.24,32 111.12,32 112.52,30.61 IC3.10 | 108.71,33.53 92.71,33.53 91.31,32.13 JP3.1 | v90.93,24 90.42,24 90.3,23.88 U2.16 | 108.71,33.53 120.4,45.21 127.76,45.21 128.91,46.35 MISC.3
MOSI  (via drill 0.25)
  Top 0.203: v107.44,24.38 v110.36,27.3 110.49,27.43 110.49,29.08 111.63,30.23 111.63,35.18 v116.84,40.39
  Bottom 0.203: v110.36,27.3 112.27,27.3 112.52,27.56 IC3.12 | v107.44,24.38 107.19,24.64 89.92,24.64 89.85,24.57 | 89.85,24.57 89.15,23.88 U2.15 | JP3.4 88.52,28.57 88.52,24.64 89.79,24.64 89.85,24.57 | v116.84,40.39 125.48,40.39 128.91,43.81 MISC.1
N$1
  Bottom 0.203: J3.1/DAT2 133.22,27.05 130.56,24.38 120.27,24.38 RN1.2
N$2
  Bottom 0.203: R2.2 8.76,58.8 7.24,58.8 PWR.K
N$3  (via drill 0.25)
  Top 0.254: v96.39,19.3 94.74,20.95 v94.74,21.72 94.87,21.84 94.87,26.54 v96.65,28.32
  Bottom 0.254: C12.2 77.85,17.27 77.85,17.65 C13.2 78.23,18.67 82.42,18.67 U2.4 83.57,18.8 84.07,18.8 84.07,19.94 84.01,20 | 84.01,20 83.95,20.07 83.57,20.07 U2.6 | v96.39,19.3 96.39,17.91 C11.2 | v94.74,21.72 94.61,21.59 92.84,21.59 92.46,21.21 92.2,21.21 U2.18 91.06,20.95 84.96,20.95 84.01,20 | v96.65,28.32 96.65,28.96 R1.1
N$6
  Top 0.61: +5V_IN.2 U1.3
  Bottom 0.61: C9.1 121.67,5.71 121.41,5.97 116.2,5.97 U1.3
N$7
  Bottom 0.203: J3.8/DAT1 133.22,35.43 132.08,36.58 120.27,36.58 RN1.7
N$13
  Bottom 0.203: IC1.21 55.75,47.62 56.52,48.39 58.8,48.39 D1.C
N$15
  Bottom 0.203: C4.2 75.95,22.61 76.07,22.73 77.22,22.73 Q1.2 78.36,22.73 79.88,21.21 82.42,21.21 U2.7
N$16  (via drill 0.25)
  Top 0.203: v82.42,22.99 78.11,27.3 Q1.1
  Bottom 0.203: C5.2 75.95,28.19 76.07,28.07 77.22,28.07 Q1.1 | v82.42,22.99 82.42,22.1 U2.8
N$18
  Bottom 0.254: C10.2 94.74,20.19 94.11,19.56 92.2,19.56 U2.20
PA0  (via drill 0.25)
  Top 0.203: v84.45,17.14 84.33,17.02 84.33,15.11 83.95,14.73 v72.77,14.73 | v10.92,17.78 9.78,18.92 9.78,30.23 IC1.2
  Bottom 0.203: v84.45,17.14 91.06,17.14 U2.23 | v72.77,14.73 69.72,17.78 v10.92,17.78
PA1  (via drill 0.25)
  Top 0.203: v87.63,16.51 85.34,14.22 78.61,14.22 v78.61,14.1 | v12.06,12.32 IC1.3
  Bottom 0.203: v87.63,16.51 89.41,16.51 89.53,16.38 91.06,16.38 U2.24 | v78.61,14.1 77.22,12.7 20.57,12.7 20.19,12.32 v12.06,12.32
PA2  (via drill 0.25)
  Top 0.203: v90.93,15.49 92.33,16.89 92.33,31.62 v86.61,37.34
  Bottom 0.203: v90.93,15.49 90.42,15.49 90.3,15.37 U2.25 | v86.61,37.34 86.49,37.47 20.19,37.47 15.11,32.38 IC1.4
PA3  (via drill 0.25)
  Top 0.203: v89.15,15.88 87.88,17.14 86.74,17.14 86.74,16.26 86.36,15.88 85.09,15.88 85.09,28.07 84.33,28.83 v84.33,31.24
  Bottom 0.203: v89.15,15.88 89.15,15.37 U2.26 | v84.33,31.24 78.61,36.96 22.23,36.96 17.65,32.38 IC1.5
PA4  (via drill 0.25)
  Top 0.203: v73.28,24.64 v80.77,17.14 | v20.07,24.64 19.94,24.77 19.94,30.23 IC1.6
  Bottom 0.203: v80.77,17.14 82.42,17.14 U2.2 | v20.07,24.64 v73.28,24.64
PA5  (via drill 0.25)
  Top 0.203: v23.11,24 22.48,24.64 22.48,30.23 IC1.7
  Bottom 0.203: v23.11,24 78.23,24 78.36,23.88 84.33,23.88 U2.9
PA6  (via drill 0.25)
  Top 0.203: v82.55,24.51 77.34,29.72 v64.39,29.72
  Bottom 0.203: v82.55,24.51 85.22,24.51 85.22,23.88 U2.10 | v64.39,29.72 64.26,29.84 25.91,29.84 25.27,30.48 IC1.8
PA7  (via drill 0.25)
  Top 0.203: v28.19,28.7 27.56,29.34 27.56,30.23 IC1.9
  Bottom 0.203: v28.19,28.7 28.32,28.7 28.32,26.16 29.34,25.15 53.21,25.15 53.34,25.27 85.98,25.27 85.98,23.88 U2.11
PD2  (via drill 0.25)
  Top 0.203: v83.69,15.37 83.69,35.31 106.68,58.29 128.91,58.29 128.91,59.05 MISC.13
  Bottom 0.203: v83.69,15.37 84.33,15.37 U2.32
PD3  (via drill 0.25)
  Top 0.203: v81.92,16.38 83.19,17.65 83.19,35.69 v104.01,56.52
  Bottom 0.203: v81.92,16.38 82.42,16.38 U2.1 | v104.01,56.52 126.36,56.52 MISC.12
RXD  (via drill 0.25)
  Top 0.203: v113.92,13.21 128.4,27.69 128.4,52.7 129.29,53.59 MISC.9
  Bottom 0.203: v113.92,13.21 86.23,13.21 86.23,14.22 U2.30
SCK  (via drill 0.25)
  Top 0.203: v90.42,21.72 89.28,22.86 89.28,30.35 88.52,31.11 JP3.3 | MISC.6 126.36,48.9 124.08,48.9 117.47,42.29 117.47,35.18 v112.01,29.72 111.38,29.08 111.38,26.42 v107.44,22.48
  Bottom 0.203: v90.42,21.72 91.06,21.72 U2.17 92.2,22.1 92.58,22.48 v107.44,22.48 | v112.01,29.72 112.14,29.72 112.52,29.34 IC3.11
SCL  (via drill 0.25)
  Top 0.203: v88.27,15.88 89.28,14.86 97.41,14.86 97.41,27.3 v121.54,51.44
  Bottom 0.203: v88.27,15.88 87.88,15.88 87.88,15.37 U2.28 | v121.54,51.44 126.36,51.44 MISC.8
SDA  (via drill 0.25)
  Top 0.203: v101.6,20.45 106.17,25.02 106.17,33.02 126.75,53.59 MISC.10
  Bottom 0.203: v101.6,20.45 94.87,13.72 88.65,13.72 88.65,14.22 U2.27
SDMISO  (via drill 0.25)
  Top 0.254: v109.35,31.5 109.47,31.62 109.47,32 v111,33.53
  Bottom 0.254: v109.35,31.5 108.46,30.61 IC3.5 | v111,33.53 111.51,34.04 117.86,34.04 RN1.6 120.27,34.04 121.28,33.02 124.59,33.02 125.22,33.66 133.22,33.66 J3.7/DAT0
SDMOSI  (via drill 0.25)
  Top 0.254: v109.09,27.81 109.98,28.7 109.98,31.62 v111,32.64
  Bottom 0.254: v109.09,27.81 108.46,27.81 IC3.3 | v111,32.64 111.89,33.53 114.81,33.53 118.43,29.91 | 118.43,29.91 118.62,29.72 RN1.4 | J3.3/CMD 133.22,29.97 118.49,29.97 118.43,29.91
SDSCK  (via drill 0.25)
  Top 0.254: v112.01,28.45 115.19,31.62 117.86,31.62 RN1.5
  Bottom 0.254: v112.01,28.45 108.84,28.45 108.46,28.83 IC3.4 | J3.5/CLK 133.22,31.88 120.27,31.88 RN1.5
TXD  (via drill 0.25)
  Top 0.203: v85.34,13.59 85.98,14.22 97.92,14.22 97.92,26.92 126.75,55.75 128.91,55.75 128.91,56.52 MISC.11
  Bottom 0.203: v85.34,13.59 85.34,14.22 U2.31
VCC  (via drill 0.3)
  Top 0.61: 106.24,9.21 104.78,7.75 +5V_IN.1 | 106.24,9.21 v113.03,16 113.28,16.13 115.95,16.13 122.81,22.99 122.81,32.51 | 122.81,32.51 122.81,39.5 126.75,43.43 MISC.2 | v116.71,30.61 120.65,30.61 122.56,32.51 122.81,32.51 | J1.7 17.4,8.13 16.89,8.64 16.89,20.19 17.78,21.08 IC2.20 | v48.51,34.67 47.88,35.31 47.88,45.47 IC1.24 | v98.55,25.27 98.55,16.89 106.24,9.21
  Bottom 0.61: 114.17,30.61 114.17,32.64 113.54,32.64 IC3.8 | 114.17,30.61 114.17,25.91 113.92,25.65 113.67,25.65 113.54,25.53 IC3.14 | 98.04,6.22 97.66,6.22 IC4.1 | 98.04,6.22 98.3,6.48 98.3,7.75 97.66,7.75 IC4.3 96.77,8.13 95.38,8.13 93.22,10.29 78.61,10.29 78.61,9.53 77.22,8.13 J1.31 | v113.03,16 113.03,21.84 C3.1 | 98.04,6.22 98.17,5.97 98.17,5.21 103.89,5.21 +5V_IN.1 | v116.71,30.61 114.17,30.61 | C7.1 5.59,18.67 8.26,21.34 14.86,21.34 C2.1 15.62,21.84 17.53,21.84 IC2.20 18.41,23.37 18.41,24.13 19.68,25.4 23.62,25.4 | 23.62,25.4 26.42,25.4 26.8,25.78 RN2.1 | PWR.A 4.7,58.8 6.1,57.4 35.18,57.4 PAR_IO.2 36.58,56.9 37.59,55.88 51.05,55.88 51.05,51.05 47.88,47.88 IC1.24 | 23.62,25.4 23.62,34.54 48.26,34.54 v48.51,34.67 54.99,34.67 55.12,34.54 C1.1 55.5,33.53 55.5,32.64 IC1.20 55.75,30.48 88.9,30.48 89.92,29.46 JP3.2 91.31,29.46 94.74,29.46 R1.2 94.87,28.96 v98.55,25.27

### Text on the board
tPlace: Pugputer 6309 - SD POWER v2.1 | 12VDC >1A | CENTER +
tNames: +5V | B2 | B4 | B6 | CB1 | GND | GND | PD2 | PD3 | TXD | SDA | RXD | SCL | ADC7 | SCK | B0 | B1 | B3 | B5 | B7 | CB2 | ADC6 | /RST | MISO | +5V | MOSI | AVRISP